# Altium schematic sheet Isolation.SchDoc
size A4
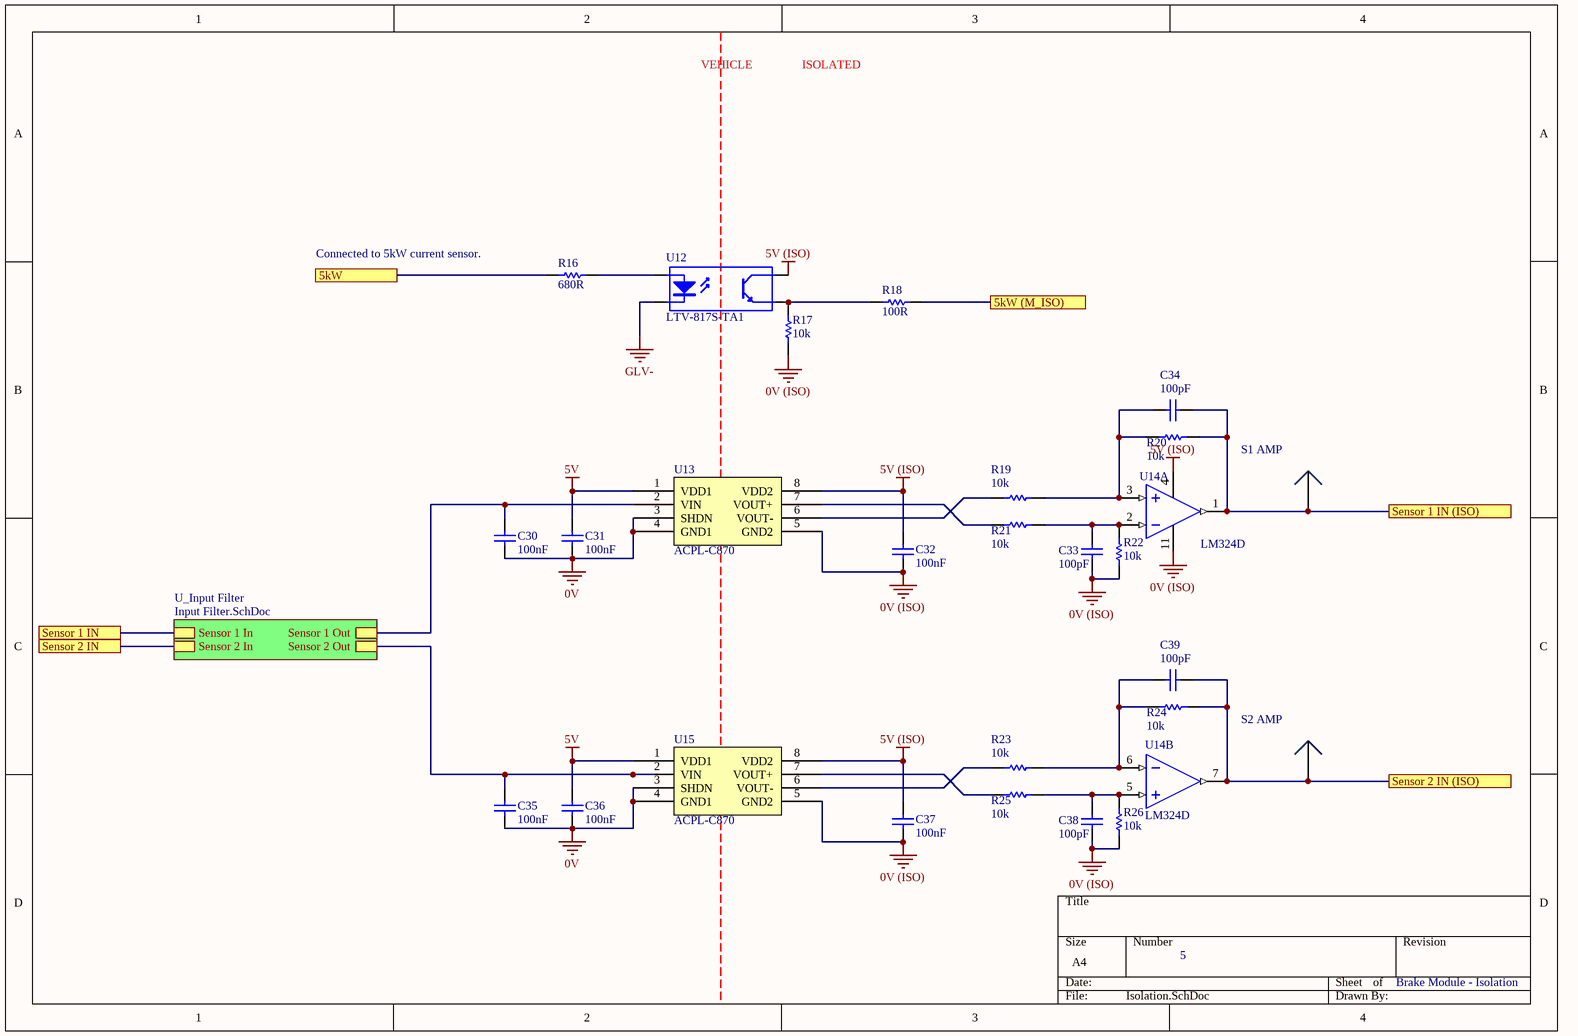
[diagram p0: Isolation.SchDoc]

## Parts
C30  100nF  [0805]
C31  100nF  [0805]
C32  100nF  [0805]
C33  100pF  [0805]
C34  100pF  [0805]
C35  100nF  [0805]
C36  100nF  [0805]
C37  100nF  [0805]
C38  100pF  [0805]
C39  100pF  [0805]
R16  680R  [0805]
R17  10k  [0805]
R18  100R  [0805]
R19  10k  [0805]
R20  10k  [0805]
R21  10k  [0805]
R22  10k  [0805]
R23  10k  [0805]
R24  10k  [0805]
R25  10k  [0805]
R26  10k  [0805]
S1_AMP  0mm  [SMD Test Point]  (value not drawn)
S2_AMP  0mm  [SMD Test Point]  (value not drawn)
U12  LTV-817S-TA1  [ON 4-SMD]
U13  ACPL-C870  [BROAD 8-SOIC]
U14  LM324D  [TI 14-SOIC]  (parts A,B of 4)
U15  ACPL-C870  [BROAD 8-SOIC]

## Sub-sheets
U_Input Filter = Input Filter.SchDoc: Sensor 1 In, Sensor 1 Out, Sensor 2 In, Sensor 2 Out

## Ports
5kW, 5kW (M_ISO), Sensor 1 IN, Sensor 1 IN (ISO), Sensor 2 IN, Sensor 2 IN (ISO)

## Nets
0V: C30.1 C31.1 C35.1 C36.1 U13.3(SHDN) U13.4(GND1) U15.3(SHDN) U15.4(GND1)
0V (ISO): C32.1 C33.1 C37.1 C38.1 R17.1 R22.1 R26.1 U13.5(GND2) U14.11(GND) U15.5(GND2)
5V: C31.2 C36.2 U13.1(VDD1) U15.1(VDD1)
5V (ISO): C32.2 C37.2 U12.4(C) U13.8(VDD2) U14.4(VCC) U15.8(VDD2)
GLV-: U12.2(K)
5kW: R16.2 ; port 5kW
5kW (M_ISO): R18.1 ; port 5kW (M_ISO)
Sensor 1 IN: port Sensor 1 IN, sheet U_Input Filter/Sensor 1 In
Sensor 1 IN (ISO): C34.1 R20.2 S1_AMP.1 U14.1(1OUT) ; port Sensor 1 IN (ISO)
Sensor 2 IN: port Sensor 2 IN, sheet U_Input Filter/Sensor 2 In
Sensor 2 IN (ISO): C39.1 R24.2 S2_AMP.1 U14.7(2OUT) ; port Sensor 2 IN (ISO)
NetC30_2: C30.2 U13.2(VIN) ; sheet U_Input Filter/Sensor 1 Out
NetC33_2: C33.2 R21.2 R22.2 U14.2(1IN+)
NetC34_2: C34.2 R19.2 R20.1 U14.3(1IN+)
NetC35_2: C35.2 U15.2(VIN) ; sheet U_Input Filter/Sensor 2 Out
NetC38_2: C38.2 R25.2 R26.2 U14.5(2IN+)
NetC39_2: C39.2 R23.2 R24.1 U14.6(2IN-)
NetR16_1: R16.1 U12.1(A)
NetR17_2: R17.2 R18.2 U12.3(E)
NetR19_1: R19.1 U13.6(VOUT-)
NetR21_1: R21.1 U13.7(VOUT+)
NetR23_1: R23.1 U15.6(VOUT-)
NetR25_1: R25.1 U15.7(VOUT+)

## Notes on the sheet
- VEHICLE
- ISOLATED
- (near R16) Connected to 5kW current sensor.
- 5
- Brake Module - Isolation

## Library data of the parts
C30-C32 C35-C37 = GCM21BR71H104KA37L: Manufacturer: muRata; Tolerance: ±10%; Material: X7R; Rated Voltage: 50V; Part Number: GCM21BR71H104KA37L; Value: 100nF; Digikey Part Number: 490-6064-1-ND
C33 C34 C38 C39 = GCM2165C1H101JA16D: Manufacturer: muRata; Tolerance: ±5%; Material: C0G, NP0; Rated Voltage: 50V; Part Number: GCM2165C1H101JA16D; Value: 100pF; Digikey Part Number: 490-8031-1-ND
R16 = RC0805FR07680RL: Manufacturer: YAGEO; Tolerance: 0.01; Rated Voltage: 0.125W; Part Number: RC0805FR07680RL; Value: 680R; Material: FR-07; Digikey Part Number: 311-680CRCT-ND
R17 R19-R26 = RC0805FR0710KL: Manufacturer: YAGEO; Tolerance: 0.01; Rated Voltage: 0.125W; Part Number: RC0805FR0710KL; Value: 10k; Material: FR-07; Digikey Part Number: 311-10.0KCRCT-ND
R18 = RC0805FR07100RL: Manufacturer: YAGEO; Tolerance: 0.01; Rated Voltage: 0.125W; Part Number: RC0805FR07100RL; Value: 100R; Material: FR-07; Digikey Part Number: 311-100CRCT-ND
S1_AMP S2_AMP = SMD Test Point: Positions: 1; Row Spacing: 0; Flange: No; Contact: NA; Part Number: SMD Test Point; Pitch: 0mm; Angle: 0
U12 = LTV-817S-TA1: 35V 50ma Optocoupler (VF=1.2V); Manufacturer: Lite-On Inc; Part Number: LTV-817S-TA1; Digikey Part Number: 160-1893-2-ND; Digikey Link: https://www.digikey.com/product-detail/en/lite-on-inc/LTV-817S-TA1/160-1893-2-ND/388451
U13 U15 = ACPL-C870: Isolation Amplifier 1 Circuit Differential 8-SO; Manufacturer: Broadcom Limited; Part Number: ACPL-C870; Digikey Part Number: 516-2578-5-ND; Digikey Link: https://www.digikey.com/product-detail/en/broadcom-limited/ACPL-C870-000E/516-2578-5-ND/3523705
U14 = LM324D: IC OPAMP GP 4 CIRCUIT 14SOIC; Manufacturer: Texas Instruments; Part Number: LM324D; Digikey Part Number: 296-1390-5-ND; Digikey Link: https://www.digikey.com/product-detail/en/texas-instruments/LM324D/296-1390-5-ND/277039